# Altium project Battery_Charger_Design.PrjPcb
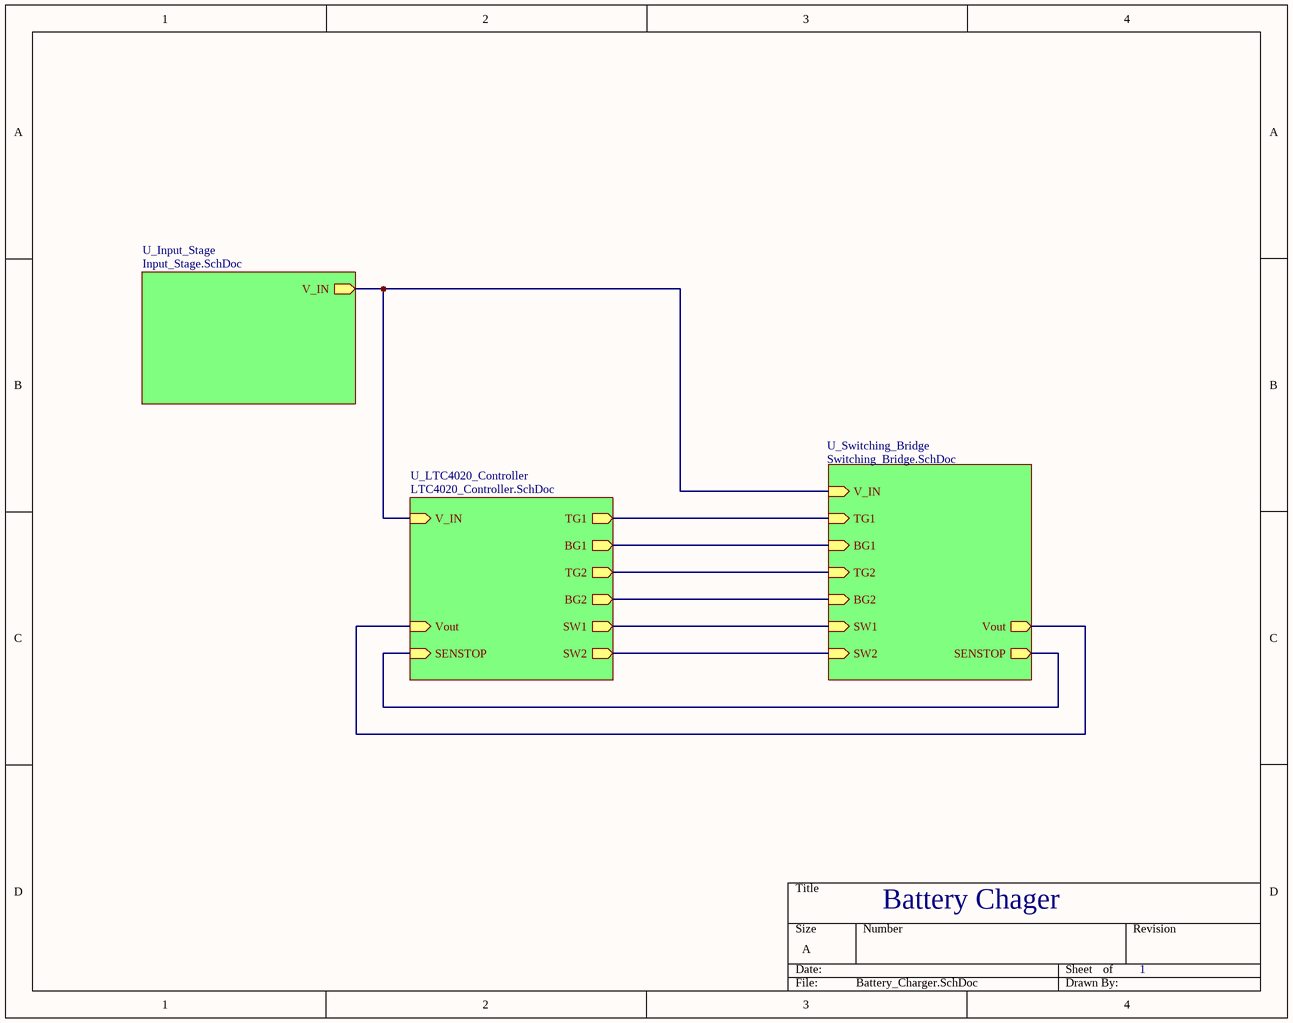
[diagram p0: Battery_Charger.SchDoc]
4 sheets, 48 parts. Net scope: hierarchical (ports join the sheet entries above them; power ports are global).
Board file: Battery_Charger.PcbDoc
Sheets:
  Battery_Charger.SchDoc
    U_LTC4020_Controller = LTC4020_Controller.SchDoc
    U_Switching_Bridge = Switching_Bridge.SchDoc
    U_Input_Stage = Input_Stage.SchDoc

## Sheet Battery_Charger.SchDoc
size A; SheetNumber: 1; SheetTotal: 4

### Sub-sheets
U_Input_Stage = Input_Stage.SchDoc: V_IN (out)
U_LTC4020_Controller = LTC4020_Controller.SchDoc: TG1 (out), BG1 (out), TG2 (out), BG2 (out), V_IN (in), SENSTOP (in), SW1 (out), SW2 (out), Vout (in)
U_Switching_Bridge = Switching_Bridge.SchDoc: BG1 (in), BG2 (in), TG1 (in), TG2 (in), V_IN (in), Vout (out), SENSTOP (out), SW1 (in), SW2 (in)

### Nets
BG1_in: sheet U_LTC4020_Controller/BG1, sheet U_Switching_Bridge/BG1
BG2_in: sheet U_LTC4020_Controller/BG2, sheet U_Switching_Bridge/BG2
SEN_STOP: sheet U_LTC4020_Controller/SENSTOP, sheet U_Switching_Bridge/SENSTOP
SW1: sheet U_LTC4020_Controller/SW1, sheet U_Switching_Bridge/SW1
SW2: sheet U_LTC4020_Controller/SW2, sheet U_Switching_Bridge/SW2
TG1_in: sheet U_LTC4020_Controller/TG1, sheet U_Switching_Bridge/TG1
TG2_in: sheet U_LTC4020_Controller/TG2, sheet U_Switching_Bridge/TG2
V_in: sheet U_LTC4020_Controller/V_IN, sheet U_Switching_Bridge/V_IN, sheet U_Input_Stage/V_IN
V_out: sheet U_LTC4020_Controller/Vout, sheet U_Switching_Bridge/Vout

### Notes on the sheet
- Battery Chager
- 1

## Sheet LTC4020_Controller.SchDoc
size A; SheetNumber: 4; SheetTotal: 4
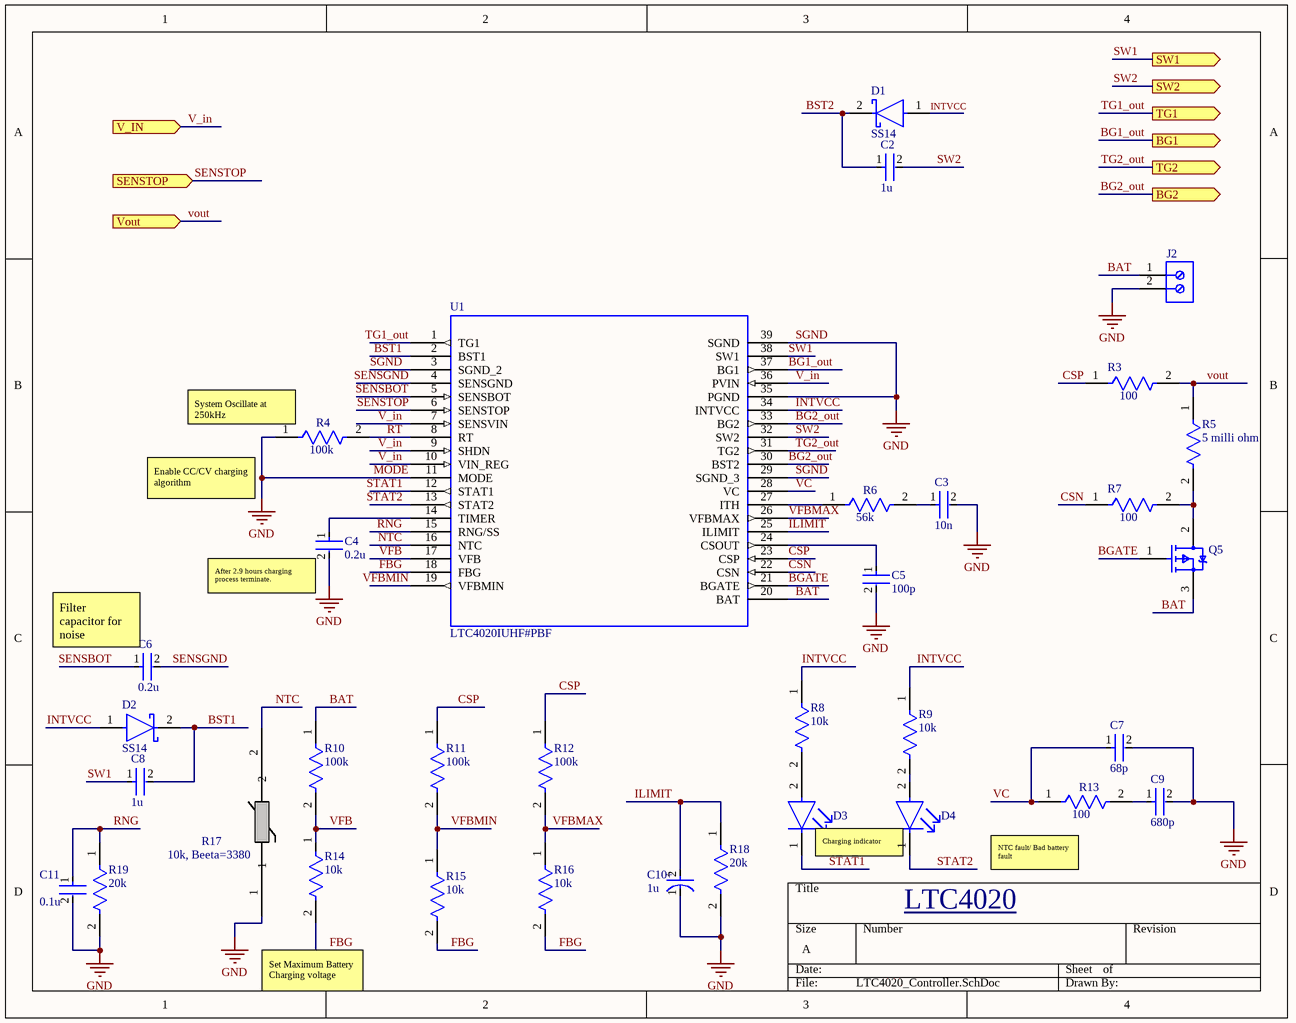
[diagram p1: LTC4020_Controller.SchDoc]

### Parts
C2  1u  [FP-C0805C-DN-MFG]
C3  10n  [FP-C0805C-DN-MFG]
C4  0.2u  [FP-C0805C-DN-MFG]
C5  100p  [FP-C0805C-DN-MFG]
C6  0.2u  [FP-C0805C-DN-MFG]
C7  68p  [FP-C0805C-DN-MFG]
C8  1u  [FP-C0805C-DN-MFG]
C9  680p  [FP-C0805C-DN-MFG]
C10  1u  [FP-RAD-TH-D_10_0_5-L_16_1-MFG]
C11  0.1u  [FP-C0805C-DN-MFG]
D1  SS14  [FP-403AE-MFG]
D2  SS14  [FP-403AE-MFG]
D3  APHCM2012CGCK-F01  [FP-APHCM2012CGCK-F01-MFG]  (value not drawn)
D4  APHCM2012CGCK-F01  [FP-APHCM2012CGCK-F01-MFG]  (value not drawn)
J2  691134710002  [691134710002]  (value not drawn)
Q5  IRF4905PBF  [FP-PG-TO220-3-MFG]  (value not drawn)
R3  100  [FP-MCU0805-IPC_C]
R4  100k  [FP-MCU0805-IPC_C]
R5  5 milli ohm  [FP-WSLP2512-0R001-0R0049-MFG]
R6  56k  [FP-MCU0805-IPC_C]
R7  100  [FP-MCU0805-IPC_C]
R8  10k  [FP-MCU0805-IPC_C]
R9  10k  [FP-MCU0805-IPC_C]
R10  100k  [FP-MCU0805-IPC_C]
R11  100k  [FP-MCU0805-IPC_C]
R12  100k  [FP-MCU0805-IPC_C]
R13  100  [FP-MCU0805-IPC_C]
R14  10k  [FP-MCU0805-IPC_C]
R15  10k  [FP-MCU0805-IPC_C]
R16  10k  [FP-MCU0805-IPC_C]
R17  10k, Beeta=3380  [NTCS0805_VIS]
R18  20k  [FP-MCU0805-IPC_C]
R19  20k  [FP-MCU0805-IPC_C]
U1  LTC4020IUHF#PBF  [QFN-38_UHF]

### Ports
BG1 (out, see Battery_Charger[2C], Switching_Bridge[1B]), BG2 (out, see Battery_Charger[2C], Switching_Bridge[1B]), SENSTOP (in, see Battery_Charger[2C], Switching_Bridge[4B]), SW1 (out, see Battery_Charger[2C], Switching_Bridge[1C]), SW2 (out, see Battery_Charger[2C], Switching_Bridge[1C]), TG1 (out, see Battery_Charger[2C], Switching_Bridge[1B]), TG2 (out, see Battery_Charger[2C], Switching_Bridge[1B]), V_IN (in, see Battery_Charger[2C], Input_Stage[4B], Switching_Bridge[1B]), Vout (in, see Battery_Charger[2C], Switching_Bridge[4B])

### Nets
MODE: C3.2 C4.2 C5.2 C7.2 C9.2 C10.1(C) C11.2 J2.2 R4.1 R17.1 R18.2 R19.2 U1.3(SGND_2) U1.11(MODE) U1.29(SGND_3) U1.35(PGND) U1.39(SGND)  [also labelled GND, SGND]
BAT: J2.1 Q5.3(SOURCE) R10.1 U1.20(BAT)
BG1_out: U1.37(BG1) ; port BG1  [project net BG1_in]
BG2_out: U1.30(BST2) U1.33(BG2) ; port BG2  [project net BG2_in]
BGATE: Q5.1(GATE) U1.21(BGATE)
BST1: C8.2 D2.2(C) U1.2(BST1)
BST2: C2.1 D1.2(C)
CSN: R7.1 U1.22(CSN)
CSP: R3.1 R11.1 R12.1 U1.23(CSP)
FBG: R14.2 R15.2 R16.2 U1.18(FBG)
ILIMIT: C10.2(A) R18.1 U1.25(ILIMIT)
INTVCC: D1.1(A) D2.1(A) R8.1 R9.1 U1.34(INTVCC)
NTC: R17.2 U1.16(NTC)
RNG: C11.1 R19.1 U1.15(RNG/SS)
RT: R4.2 U1.8(RT)
SENSBOT: C6.1 U1.5(SENSBOT)
SENSGND: C6.2 U1.4(SENSGND)
SENSTOP: U1.6(SENSTOP) ; port SENSTOP  [project net SEN_STOP]
STAT1: D3.1(C) U1.12(STAT1)
STAT2: D4.1(C) U1.13(STAT2)
SW1: C8.1 U1.38(SW1) ; port SW1
SW2: C2.2 U1.32(SW2) ; port SW2
TG1_out: U1.1(TG1) ; port TG1  [project net TG1_in]
TG2_out: U1.31(TG2) ; port TG2  [project net TG2_in]
V_in: U1.7(SENSVIN) U1.9(SHDN) U1.10(VIN_REG) U1.36(PVIN) ; port V_IN
VC: C7.1 R13.1 U1.28(VC)
VFB: R10.2 R14.1 U1.17(VFB)
VFBMAX: R12.2 R16.1 U1.26(VFBMAX)
VFBMIN: R11.2 R15.1 U1.19(VFBMIN)
vout: R3.2 R5.1 ; port Vout  [project net V_out]
NetC3_1: C3.1 R6.2
NetC4_1: C4.1 U1.14(TIMER)
NetC5_1: C5.1 U1.24(CSOUT)
NetC9_1: C9.1 R13.2
NetD3_2: D3.2(A) R8.2
NetD4_2: D4.2(A) R9.2
NetQ5_2: Q5.2(DRAIN) R5.2 R7.2
NetR6_1: R6.1 U1.27(ITH)

### Notes on the sheet
- (near R4) System Oscillate at 250kHz
- (near R4) Enable CC/CV charging algorithm
- (near C6) Filter capacitor for noise reduction
- (near C4) After 2.9 hours charging process terminate.
- Charging indicator
- (near R13) NTC fault/ Bad battery fault
- LTC4020 <https://www.analog.com/media/en/technical-documentation/data-sheets/ltc4020.pdf>
- Set Maximum Battery Charging voltage
- (in symbol CMP-05427-000510-1) +

### Library data of the parts
C2-C9 C11 = CMP-2007-00279-2: CAP CER 0.1UF 50V X7R 0805; Manufacturer Part Number: C0805C104K5RACTU; Manufacturer: KEMET; Value: 0.10 μF; Tolerance: 0.1; Temperature Coefficient: 30ppm/°C; Material: Ceramic; Device Class L2: Capacitors; Temperature Range Low: -55°C; Voltage Rating: 50 V; Digikey Description: CAP CER 0.1UF 50V X7R 0805; Category: Cap; ComponentLink2Description: Datasheet; Octopart: https://octopart.com/c0805c104k5ractu-kemet-143926; RoHS: TRUE; ComponentLink2URL: https://content.kemet.com/datasheets/KEM_C1003_C0G_SMD.pdf; Temperature Characteristic: X7R; Temperature: -55°C to +125°C; Height: 0.88mm; Temperature Range High: +125°C; Device Class L1: Passive Components; Automotive: No; Lead Free: Yes; Ipc Land Pattern Name: CAPC200125X78; Device Class L3: Ceramic Capacitors; Mouser Description: Cap Ceramic 0.1uF 50V X7R 10% SMD 2.0 x 1.2 mm 125 C Paper T/R; Capacitance: 0.10 μF; Package: C0805C-DN
C10 = CMP-05427-000510-1: Aluminum Electrolytic Capacitors (Radial Lead Type) AEC-Q200 Qualified 820uF ±20% 10V; ESR (Equivalent Series Resistance): 68mR; Ripple Current: 1.05A; Lead Diameter: 0.6mm; Dielectric Material: Aluminium; Leakage Current: 3uA; Life (Hours): 3000Hour; Package Quantity: 200; Construction: RADIAL; Radiation Hardening: No; Voltage Rating: 10V; Height - Seated (Max): 0.63inch; Case/Package: Radial; Lead Free: Lead Free; Voltage Rating (DC): 10V; Voltage: 10V; RoHS Compliant: Yes; Max Operating Temperature: 105°C; Number of Pins: 2; Impedance: 68mR; Length: 16mm; REACH SVHC: No SVHC; Lead Pitch: 5mm; Termination: Radial; Mount: Through Hole; Capacitance: 820uF; Min Operating Temperature: -55°C; Diameter: 10mm; Height: 16mm; Ripple Current (AC): 1.05A; Series: FC; Packaging: Bulk; Tolerance: 20%
D1 D2 = CMP-2000-04943-2: DIODE SCHOTTKY 40V 1A SMA; Manufacturer: ON Semiconductor; Peak Reverse Current: 0.2mA; Max Junction Temp: +125°C; Standoff Height: 0.05mm; Max Surge Forward Current: 40A; Mouser Description: Schottky Diodes & Rectifiers SMA 40V 1.0A; RoHS: TRUE; Lead Free: Yes; Manufacturer Part Number: SS14; Device Class L3: Schottky Diodes; Category: Diode; Automotive: No; Digikey Description: DIODE SCHOTTKY 40V 1A SMA; ComponentLink2Description: Datasheet; Device Class L2: Diodes; Height: 2.5mm; Temperature Range High: +125°C; ComponentLink2URL: https://www.onsemi.com/pub/Collateral/SS19-D.PDF; Device Class L1: Discrete Semiconductors; Package: 403AE; Octopart: https://octopart.com/ss14-on+semiconductor-29205033; Max Repetitive Reverse Voltage: 40V; Temperature Range Low: -65°C; Forward Current: 1A; Temperature: -65°C to +125°C
D3 = CMP-44529-000062-1: LED GREEN CLEAR CHIP SMD; Dominant Wavelength: 570nm; Forward Current: 20mA; Number of LEDs: 1; Luminous Intensity: 40mcd; Forward Voltage: 2.1V; Viewing Angle: 110°; Illumination Color: Green; Lens Style: Clear; Mount: Surface Mount; Length: 2mm; Max Operating Temperature: 85°C; Series: APHCM; Width: 1.25mm; Lead Free: Lead Free; Wavelength: 570nm; Package Quantity: 1; Number of Pins: 2; Case Code (Metric): 2012; RoHS Compliant: Yes; Packaging: Tape and Reel; Lens Color: Clear; Case/Package: 0805; Case Code (Imperial): 0805; Test Current: 20mA; Color: Green; Min Operating Temperature: -40°C; Height: 0.4mm
D4 = CMP-44529-000062-1: LED RED CLEAR CHIP SMD; Illumination Color: Green; Dominant Wavelength: 570nm; Forward Current: 20mA; Number of LEDs: 1; Luminous Intensity: 40mcd; Forward Voltage: 2.1V; Viewing Angle: 110°; Lens Style: Clear; Mount: Surface Mount; Length: 2mm; Max Operating Temperature: 85°C; Series: APHCM; Width: 1.25mm; Lead Free: Lead Free; Wavelength: 570nm; Package Quantity: 1; Number of Pins: 2; Case Code (Metric): 2012; RoHS Compliant: Yes; Packaging: Tape and Reel; Lens Color: Clear; Case/Package: 0805; Case Code (Imperial): 0805; Test Current: 20mA; Color: Green; Min Operating Temperature: -40°C; Height: 0.4mm
J2 = CMP-1502-03295-3: Wire-To-Board Terminal Block, 5mm Pitch, Horizontal, Screw, 2 Poles
Q5 = CMP-32901-000200-1: MOSFET P-CH 55V 74A TO-220AB; Drain to Source Resistance: 20mR; Input Capacitance: 3.4nF; Max Dual Supply Voltage: -55V; Power Dissipation: 200W; Turn-On Delay Time: 18ns; Element Configuration: Single; Threshold Voltage: -4V; Gate to Source Voltage (Vgs): 20V; Turn-Off Delay Time: 61ns; Number of Pins: 3; Packaging: Rail/Tube; RoHS Compliant: Yes; REACH SVHC: No SVHC; Halogen Free: Halogen Free; Max Power Dissipation: 200W; Drain to Source Breakdown Voltage: -55V; Length: 0.414inch; Drain to Source Voltage (Vdss): -55V; Height: 0.6inch; Case/Package: TO-220; Width: 0.185inch; Continuous Drain Current (ID): 74A; Mount: Through Hole; Min Operating Temperature: -55°C; Lead Free: Lead Free; Max Operating Temperature: 175°C; Rds On Max: 20mR
R3 R4 R6-R16 R18 R19 = CMP-02407-001247-1: RES 1.05K OHM 0.5% 1/5W 0805
R5 = CMP-00030-58203087-1: WSLP25122L500FEA SMD Chip Resistor, 5 milli ohm Ohm, ± 1%, 3 W, 2512 [6332 Metric], Metal Strip, Power; NexarPartId: 58203087; RoHS: Non-Compliant
R17 = CMP-00030-44434792-1: NTCS0805E3153FMT Thermistor NTC 15K Ohm 1% 2-Pin 0805 Surface Mount Solder Pad 3700K -4.5 to -4 T/R Automotive; Resistance: 15kΩ; Max Power Dissipation: 210mW; Termination: SMD/SMT; Max Operating Temperature: 150°C; Case Code (Metric): 2012; Case/Package: 0805; Mount: Surface Mount; Lead Free: Contains Lead; Packaging: Digi-Reel®; Accuracy: 1%; NexarPartId: 44434792; Depth: 1.25mm; Radiation Hardening: No; Schedule B: 8533400080, 8533400080; Length: 2mm; Min Operating Temperature: -40°C; Tolerance: 1%; Case Code (Imperial): 0805; Number of Pins: 2; RoHS: Compliant; Power Rating: 210mW
U1 = LTC4020IUHF#PBF: 55V Buck-Boost Multi-Chemistry Battery Charger; MF: Analog Devices; SnapEDA_Link: https://www.snapeda.com/parts/LTC4020IUHF%23PBF/Analog+Devices/view-part/?ref=snap; Package: QFN-38 Linear Technology; Value: *; MP: LTC4020IUHF#PBF; Check_prices: https://www.snapeda.com/parts/LTC4020IUHF%23PBF/Analog+Devices/view-part/?ref=eda

## Sheet Switching_Bridge.SchDoc
size A; SheetNumber: 3; SheetTotal: 4
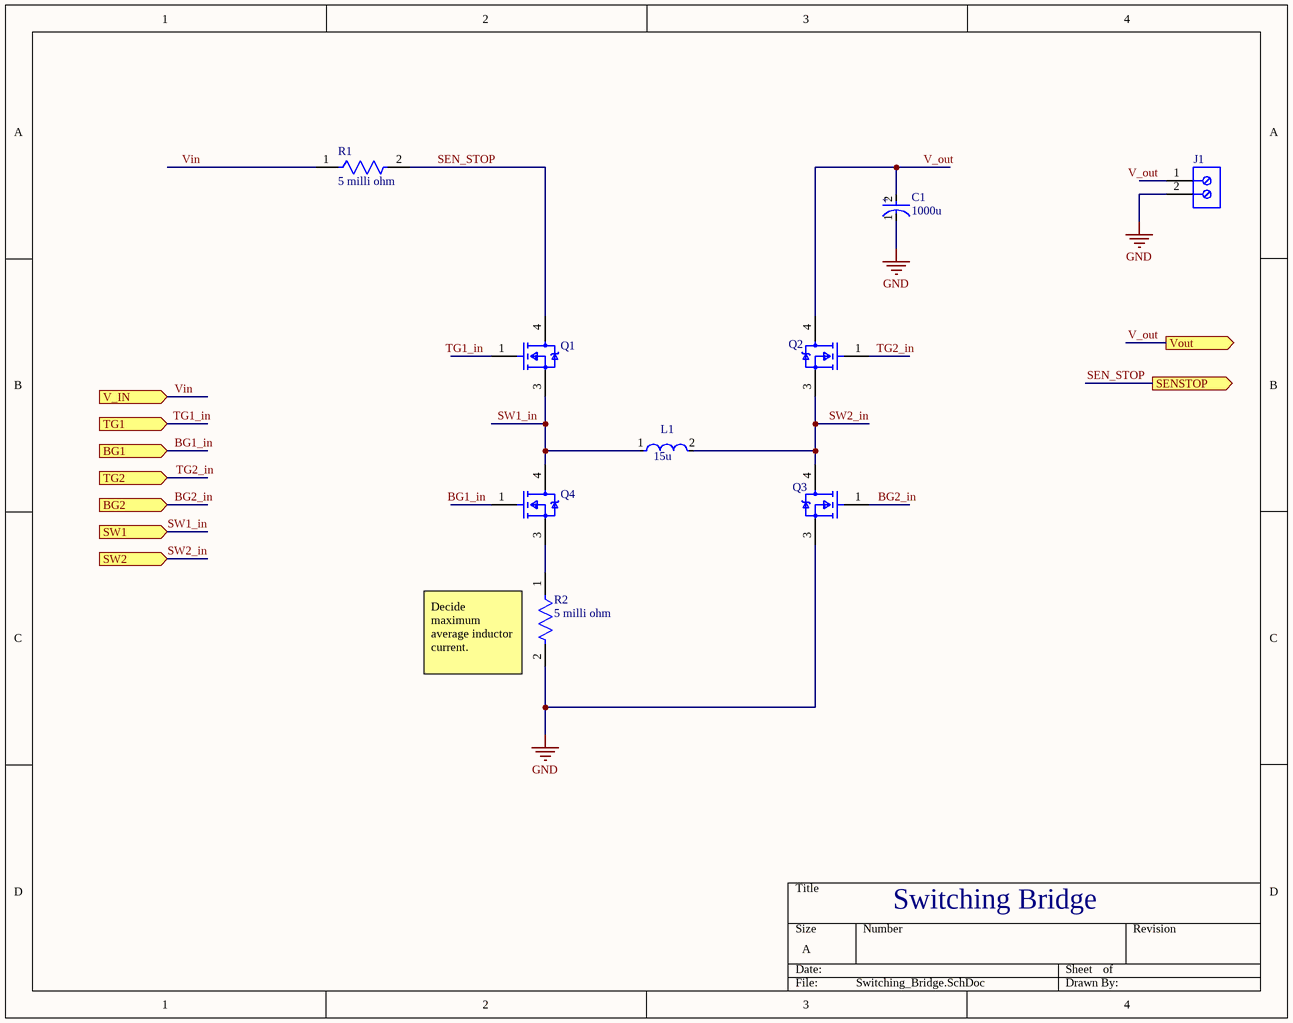
[diagram p2: Switching_Bridge.SchDoc]

### Parts
C1  1000u  [FP-RAD-TH-D_10_0_5-L_25_2-MFG]
J1  691134710002  [691134710002]  (value not drawn)
L1  15u  [FP-SRP1038WA-MFG]
Q1  IRF540NSTRLPBF  [FP-PG-TO263-3-MFG]  (value not drawn)
Q2  IRF540NSTRLPBF  [FP-PG-TO263-3-MFG]  (value not drawn)
Q3  IRF540NSTRLPBF  [FP-PG-TO263-3-MFG]  (value not drawn)
Q4  IRF540NSTRLPBF  [FP-PG-TO263-3-MFG]  (value not drawn)
R1  5 milli ohm  [FP-WSLP2512-0R001-0R0049-MFG]
R2  5 milli ohm  [FP-WSLP2512-0R001-0R0049-MFG]

### Ports
BG1 (in, see Battery_Charger[3C], LTC4020_Controller[4A]), BG2 (in, see Battery_Charger[3C], LTC4020_Controller[4A]), SENSTOP (out, see Battery_Charger[4C], LTC4020_Controller[1A]), SW1 (in, see Battery_Charger[3C], LTC4020_Controller[4A]), SW2 (in, see Battery_Charger[3C], LTC4020_Controller[4A]), TG1 (in, see Battery_Charger[3C], LTC4020_Controller[4A]), TG2 (in, see Battery_Charger[3C], LTC4020_Controller[4A]), V_IN (in, see Battery_Charger[3B], Input_Stage[4B], LTC4020_Controller[1A]), Vout (out, see Battery_Charger[4C], LTC4020_Controller[1A])

### Nets
GND: C1.1(C) J1.2 Q3.3(SOURCE) R2.2  [project net MODE]
BG1_in: Q4.1(GATE) ; port BG1
BG2_in: Q3.1(GATE) ; port BG2
SEN_STOP: Q1.4(DRAIN) R1.2 ; port SENSTOP
SW1_in: L1.1 Q1.3(SOURCE) Q4.4(DRAIN) ; port SW1  [project net SW1]
SW2_in: L1.2 Q2.3(SOURCE) Q3.4(DRAIN) ; port SW2  [project net SW2]
TG1_in: Q1.1(GATE) ; port TG1
TG2_in: Q2.1(GATE) ; port TG2
V_out: C1.2(A) J1.1 Q2.4(DRAIN) ; port Vout
Vin: R1.1 ; port V_IN  [project net V_in]
NetQ4_3: Q4.3(SOURCE) R2.1

### Notes on the sheet
- (near R2) Decide maximum average inductor current.
- Switching Bridge
- (in symbol CMP-05427-001179-1) +

### Library data of the parts
C1 = CMP-05427-001179-1: Aluminum Electrolytic Capacitors (Radial Lead Type) 1000uF ±20% 35V; Voltage: 25V; ESR (Equivalent Series Resistance): 18mR; Ripple Current: 2.47A; Capacitance: 1mF; Life (Hours): 10000Hour; Polarity: Polar; Lead Diameter: 0.6mm; Lead/Base Style: Straight; Height: 25mm; Tolerance: 20%; Length: 25mm; Voltage Rating (DC): 25V; Mount: Through Hole; RoHS Compliant: Yes; REACH SVHC: No SVHC; Max Operating Temperature: 105°C; Lead Pitch: 5mm; Series: FR; Package Quantity: 200; Contact Plating: Tin; Impedance: 18mR; Packaging: Bulk; Diameter: 10mm; Case/Package: Radial; Termination: Radial; Construction: RADIAL; Voltage Rating: 25V; Min Operating Temperature: -40°C; Radiation Hardening: No; Height - Seated (Max): 1.063inch
J1 = CMP-1502-03295-3: as J2 on sheet LTC4020_Controller
L1 = CMP-07248-000131-1: IND,11X10X3.8MM,3.3UH20%,15A,SHD
Q1-Q4 = CMP-00196-65873407-1: IRF540NSTRLPBF Transistor MOSFET N Channel 100 Volt 33 Amp 3-Pin 2+ Tab D2pak Tape And Reel; Drain to Source Voltage (Vdss): 100V; Rise Time: 35ns; Resistance: 44MΩ; Gate to Source Voltage (Vgs): 20V; Turn-Off Delay Time: 39ns; Recovery Time: 170ns; Number of Elements: 1; Max Junction Temperature (Tj): 175°C; Nominal Vgs: 4V; Element Configuration: Single; Current Rating: 33A; Power Dissipation: 3.8W; Turn-On Delay Time: 11ns; Input Capacitance: 1.96nF; Rds On Max: 8.4mΩ; Min Operating Temperature: -55°C; Lead Free: Lead Free; Packaging: Bulk; Voltage Rating (DC): 100V; Radiation Hardening: No; Height: 4.826mm; Schedule B: 8541290080, 8541290080; Mount: Surface Mount; Drain to Source Breakdown Voltage: 100V; Number of Pins: 3; Contact Plating: Tin; NexarPartId: 65873407; Max Operating Temperature: 175°C; Continuous Drain Current (ID): 33A; Termination: SMD/SMT; On-State Resistance: 44mΩ; Threshold Voltage: 4V; RoHS: Compliant; Dual Supply Voltage: 100V; Max Power Dissipation: 3.8W; Lifecycle Status: NRND; Width: 9.65mm; Drain to Source Resistance: 44mΩ; Fall Time: 35ns; Case/Package: D2PAK; Length: 10.668mm; Number of Channels: 1; Package Quantity: 800; REACH SVHC: No SVHC
R1 R2 = CMP-00030-58203087-1: as R5 on sheet LTC4020_Controller; NexarPartId: 58203087; RoHS: Non-Compliant

## Sheet Input_Stage.SchDoc
size A; SheetNumber: 2; SheetTotal: 4
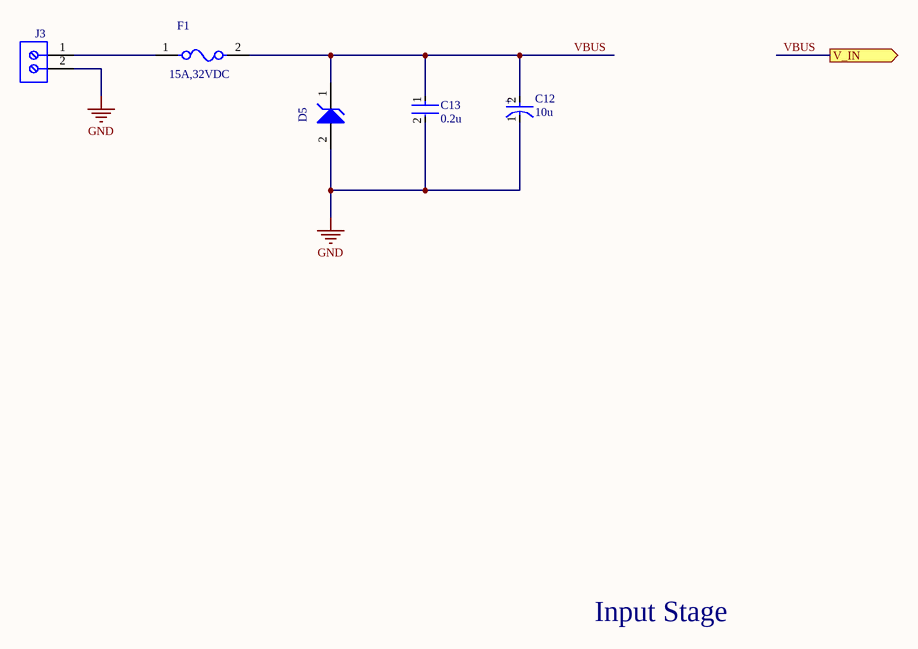
[diagram p3: Input_Stage.SchDoc]

### Parts
C12  10u  [FP-RAD-TH-D_10_0_5-L_16_1-MFG]
C13  0.2u  [FP-C0805C-DN-MFG]
D5  824540301  [WE-TVSP_DO-214AB_Unidirectional]  (value not drawn)
F1  15A,32VDC  [FP-SF-1206HHA-R-MFG]
J3  691134710002  [691134710002]  (value not drawn)

### Ports
V_IN (out, see Battery_Charger[2B], LTC4020_Controller[1A], Switching_Bridge[1B])

### Nets
GND: C12.1(C) C13.2 D5.2(A) J3.2  [project net MODE]
VBUS: C12.2(A) C13.1 D5.1(K) F1.2 ; port V_IN  [project net V_in]
NetF1_1: F1.1 J3.1

### Notes on the sheet
- Input Stage
- (in symbol CMP-05427-000510-1) +

### Library data of the parts
C12 = CMP-05427-000510-1: as C10 on sheet LTC4020_Controller; Package Quantity: 200; Construction: RADIAL; Radiation Hardening: No; Voltage Rating: 10V; Height - Seated (Max): 0.63inch; Case/Package: Radial; Lead Free: Lead Free; Voltage Rating (DC): 10V; Voltage: 10V; RoHS Compliant: Yes; Max Operating Temperature: 105°C; Number of Pins: 2; Impedance: 68mR; Length: 16mm; REACH SVHC: No SVHC; Lead Pitch: 5mm; Termination: Radial; Mount: Through Hole; Capacitance: 820uF; Min Operating Temperature: -55°C; Diameter: 10mm; Height: 16mm; Ripple Current (AC): 1.05A; Series: FC; Packaging: Bulk; Tolerance: 20%
C13 = CMP-2007-00279-2: as C2 on sheet LTC4020_Controller; Device Class L2: Capacitors; Temperature Range Low: -55°C; Voltage Rating: 50 V; Digikey Description: CAP CER 0.1UF 50V X7R 0805; Category: Cap; ComponentLink2Description: Datasheet; Octopart: https://octopart.com/c0805c104k5ractu-kemet-143926; RoHS: TRUE; ComponentLink2URL: https://content.kemet.com/datasheets/KEM_C1003_C0G_SMD.pdf; Temperature Characteristic: X7R; Temperature: -55°C to +125°C; Height: 0.88mm; Temperature Range High: +125°C; Device Class L1: Passive Components; Automotive: No; Lead Free: Yes; Ipc Land Pattern Name: CAPC200125X78; Device Class L3: Ceramic Capacitors; Mouser Description: Cap Ceramic 0.1uF 50V X7R 10% SMD 2.0 x 1.2 mm 125 C Paper T/R; Capacitance: 0.10 μF; Package: C0805C-DN
D5 = CMP-03913-71101661-2: Tvs Diode, 1.5KW, 30V, Unidir, DO-214AB; Peak Pulse Current: 31A; Number of Unidirectional Channels: 1; Breakdown Voltage: 35.05V; Clamping Voltage: 48.4V; Polarity: Unidirectional; Power Line Protection: No; Leakage Current: 1µA; Peak Pulse Power: 1.5kW; RoHS: Compliant; Length: 6.86mm; Max Operating Temperature: 150°C; Number of Pins: 2; Max Breakdown Voltage: 35.05V; Packaging: Cut Tape; REACH SVHC: Unknown; Width: 5.91mm; Min Operating Temperature: -65°C; Reverse Standoff Voltage: 30V; Composition: Zener; Mount: Surface Mount; Height: 2.5mm; Min Breakdown Voltage: 35.05V
F1 = CMP-00059-142019744-1: SF-1206HHA1500R-2 Fuse Chip 15A 50V SMD Solder Pad 1206 3.2 X 1.65 X 1mm; Resistance: 2.6mΩ; Min Operating Temperature: -55°C; Case/Package: 1206; Height: 1.2mm; Max Operating Temperature: 125°C; Fuse Current: 15A; Voltage Rating: 50V; NexarPartId: 142019744
J3 = CMP-1502-03295-3: as J2 on sheet LTC4020_Controller

## Nets that join several sheets
MODE: LTC4020_Controller (17 pins), Switching_Bridge (C1.1 J1.2 Q3.3 R2.2), Input_Stage (C12.1 C13.2 D5.2 J3.2)
BG1_in: LTC4020_Controller (U1.37), Switching_Bridge (Q4.1)
BG2_in: LTC4020_Controller (U1.30 U1.33), Switching_Bridge (Q3.1)
SEN_STOP: LTC4020_Controller (U1.6), Switching_Bridge (Q1.4 R1.2)
SW1: LTC4020_Controller (C8.1 U1.38), Switching_Bridge (L1.1 Q1.3 Q4.4)
SW2: LTC4020_Controller (C2.2 U1.32), Switching_Bridge (L1.2 Q2.3 Q3.4)
TG1_in: LTC4020_Controller (U1.1), Switching_Bridge (Q1.1)
TG2_in: LTC4020_Controller (U1.31), Switching_Bridge (Q2.1)
V_in: LTC4020_Controller (U1.7 U1.9 U1.10 U1.36), Switching_Bridge (R1.1), Input_Stage (C12.2 C13.1 D5.1 F1.2)
V_out: LTC4020_Controller (R3.2 R5.1), Switching_Bridge (C1.2 J1.1 Q2.4)